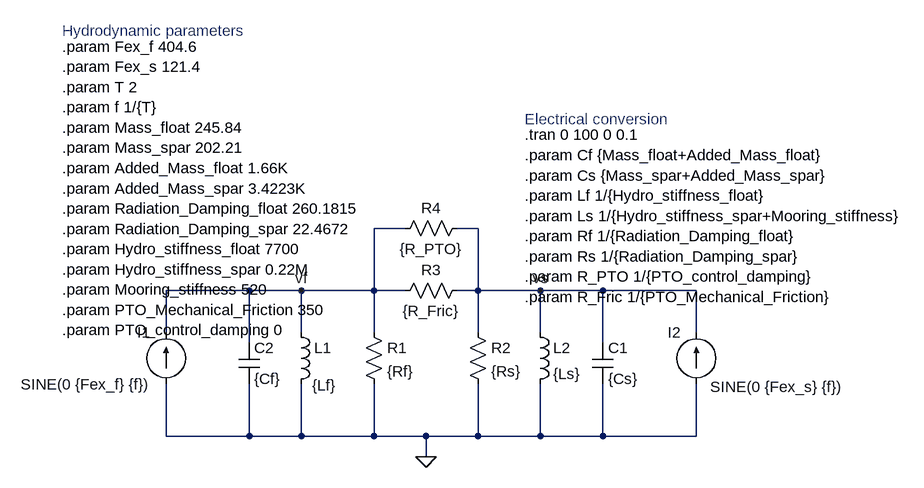
[diagram p0: schematic LUPA.asc]
LUPA.asc, the LTspice schematic file:
Version 4
SHEET 1 1404 680
WIRE 432 208 384 208
WIRE 544 208 512 208
WIRE 192 304 64 304
WIRE 272 304 192 304
WIRE 384 304 384 208
WIRE 384 304 272 304
WIRE 432 304 384 304
WIRE 544 304 544 208
WIRE 544 304 512 304
WIRE 640 304 544 304
WIRE 736 304 640 304
WIRE 880 304 736 304
WIRE 64 368 64 304
WIRE 272 368 272 304
WIRE 384 368 384 304
WIRE 544 368 544 304
WIRE 640 368 640 304
WIRE 880 368 880 304
WIRE 192 384 192 304
WIRE 736 384 736 304
WIRE 64 528 64 448
WIRE 192 528 192 448
WIRE 192 528 64 528
WIRE 272 528 272 448
WIRE 272 528 192 528
WIRE 384 528 384 448
WIRE 384 528 272 528
WIRE 464 528 384 528
WIRE 544 528 544 448
WIRE 544 528 464 528
WIRE 640 528 640 448
WIRE 640 528 544 528
WIRE 736 528 736 448
WIRE 736 528 640 528
WIRE 880 528 880 448
WIRE 880 528 736 528
WIRE 464 560 464 528
FLAG 464 560 0
FLAG 272 304 vf
FLAG 640 304 vs
SYMBOL current 64 448 R180
WINDOW 0 24 80 Left 2
WINDOW 3 24 0 Left 2
WINDOW 123 0 0 Left 0
WINDOW 39 0 0 Left 0
SYMATTR InstName I1
SYMATTR Value SINE(0 {Fex_f} {f})
SYMBOL current 880 448 R180
WINDOW 0 24 80 Left 2
WINDOW 3 -21 -4 Right 2
WINDOW 123 0 0 Left 0
WINDOW 39 0 0 Left 0
SYMATTR InstName I2
SYMATTR Value SINE(0 {Fex_s} {f})
SYMBOL cap 720 384 R0
SYMATTR InstName C1
SYMATTR Value {Cs}
SYMATTR SpiceLine Rser=0 Lser=0 Rpar=0 Cpar=0
SYMBOL cap 176 384 R0
SYMATTR InstName C2
SYMATTR Value {Cf}
SYMATTR SpiceLine Rser=0 Lser=0 Rpar=0 Cpar=0
SYMBOL ind 256 352 R0
WINDOW 3 33 98 Left 2
SYMATTR Value {Lf}
SYMATTR InstName L1
SYMATTR SpiceLine Rser=0 Rpar=0 Cpar=0
SYMBOL ind 624 352 R0
SYMATTR InstName L2
SYMATTR Value {Ls}
SYMATTR SpiceLine Rser=0 Rpar=0 Cpar=0
SYMBOL res 368 352 R0
SYMATTR InstName R1
SYMATTR Value {Rf}
SYMBOL res 528 352 R0
SYMATTR InstName R2
SYMATTR Value {Rs}
SYMBOL res 416 320 R270
WINDOW 0 32 56 VTop 2
WINDOW 3 0 56 VBottom 2
SYMATTR InstName R3
SYMATTR Value {R_Fric}
SYMBOL res 528 192 R90
WINDOW 0 0 56 VBottom 2
WINDOW 3 32 56 VTop 2
SYMATTR InstName R4
SYMATTR Value {R_PTO}
TEXT 616 64 Left 2 !.tran 0 100 0 0.1\n.param Cf {Mass_float+Added_Mass_float}\n.param Cs {Mass_spar+Added_Mass_spar}\n.param Lf 1/{Hydro_stiffness_float}\n.param Ls 1/{Hydro_stiffness_spar+Mooring_stiffness}\n.param Rf 1/{Radiation_Damping_float}\n.param Rs 1/{Radiation_Damping_spar}\n.param R_PTO 1/{PTO_control_damping}\n.param R_Fric 1/{PTO_Mechanical_Friction}
TEXT -96 -72 Left 2 !.param Fex_f 404.6\n.param Fex_s 121.4\n.param T 2\n.param f 1/{T}\n.param Mass_float 245.84\n.param Mass_spar 202.21\n.param Added_Mass_float 1.66K\n.param Added_Mass_spar 3.4223K\n.param Radiation_Damping_float 260.1815 \n.param Radiation_Damping_spar 22.4672\n.param Hydro_stiffness_float 7700\n.param Hydro_stiffness_spar 0.22M\n.param Mooring_stiffness 520\n.param PTO_Mechanical_Friction 350\n.param PTO_control_damping 0
TEXT 616 40 Left 2 ;Electrical conversion
TEXT -96 -96 Left 2 ;Hydrodynamic parameters

The netlist it stands for:
* LUPA.asc
I1 0 vf SINE(0 {Fex_f} {f})
I2 0 vs SINE(0 {Fex_s} {f})
C1 vs 0 {Cs} Rser=0 Lser=0 Rpar=0 Cpar=0
C2 vf 0 {Cf} Rser=0 Lser=0 Rpar=0 Cpar=0
L1 vf 0 {Lf} Rser=0 Rpar=0 Cpar=0
L2 vs 0 {Ls} Rser=0 Rpar=0 Cpar=0
R1 vf 0 {Rf}
R2 vs 0 {Rs}
R3 vf vs {R_Fric}
R4 vs vf {R_PTO}
.tran 0 100 0 0.1
.param Cf {Mass_float+Added_Mass_float}
.param Cs {Mass_spar+Added_Mass_spar}
.param Lf 1/{Hydro_stiffness_float}
.param Ls 1/{Hydro_stiffness_spar+Mooring_stiffness}
.param Rf 1/{Radiation_Damping_float}
.param Rs 1/{Radiation_Damping_spar}
.param R_PTO 1/{PTO_control_damping}
.param R_Fric 1/{PTO_Mechanical_Friction}
.param Fex_f 404.6
.param Fex_s 121.4
.param T 2
.param f 1/{T}
.param Mass_float 245.84
.param Mass_spar 202.21
.param Added_Mass_float 1.66K
.param Added_Mass_spar 3.4223K
.param Radiation_Damping_float 260.1815
.param Radiation_Damping_spar 22.4672
.param Hydro_stiffness_float 7700
.param Hydro_stiffness_spar 0.22M
.param Mooring_stiffness 520
.param PTO_Mechanical_Friction 350
.param PTO_control_damping 0
* Electrical conversion
* Hydrodynamic parameters
.backanno
.end